# EAGLE design FR5969 (EAGLE 9.6.2)
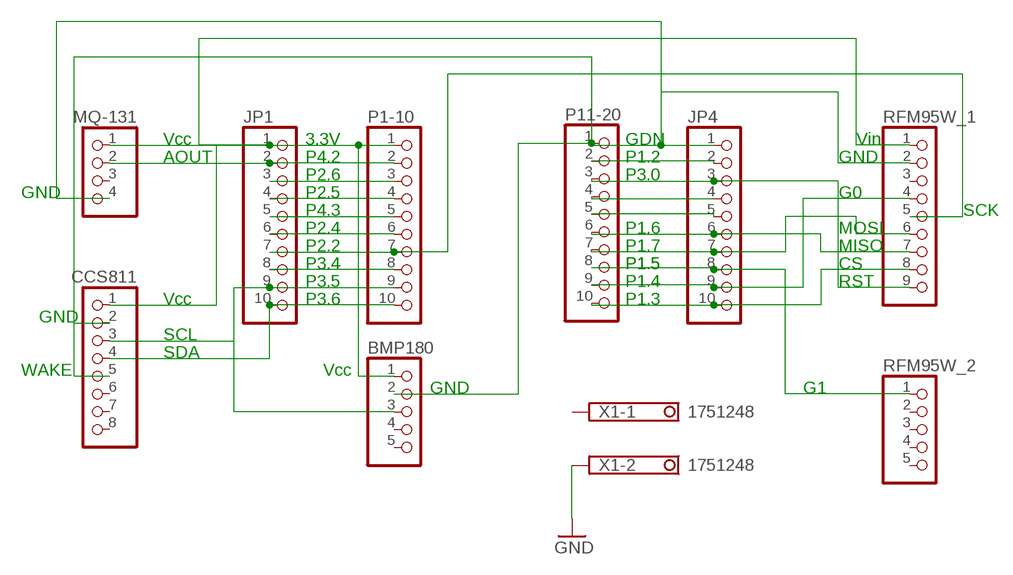
[diagram p0: schematic, sheet 1]

## Parts
BMP180  PINHD-1X5  [1X05]
CCS811  PINHD-1X8  [1X08]
JP1  PINHD-1X10  [1X10]
JP4  PINHD-1X10  [1X10]
MQ-131  PINHD-1X4  [1X04]
P1-10  PINHD-1X10  [1X10]
P11-20  PINHD-1X10  [1X10]
RFM95W_1  PINHD-1X9  [1X09]
RFM95W_2  PINHD-1X5  [1X05]
X1  1751248  [1751248]

## Nets
GND: X1.2
N$1: BMP180.1 CCS811.1 JP1.1 MQ-131.1 P1-10.1 RFM95W_1.1
N$2: JP1.2 MQ-131.2 P1-10.2
N$3: JP1.3 P1-10.3
N$4: JP1.4 P1-10.4
N$5: JP1.5 P1-10.5
N$6: JP1.6 P1-10.6
N$7: JP1.7 P1-10.7 RFM95W_1.5
N$8: JP1.8 P1-10.8
N$9: BMP180.3 CCS811.3 JP1.9 P1-10.9
N$10: CCS811.4 JP1.10 P1-10.10
N$11: JP4.10 P11-20.10 RFM95W_1.8
N$12: JP4.9 P11-20.9 RFM95W_1.4
N$13: JP4.8 P11-20.8 RFM95W_2.1
N$14: JP4.7 P11-20.7 RFM95W_1.6
N$15: JP4.6 P11-20.6 RFM95W_1.7
N$16: JP4.5 P11-20.5
N$17: JP4.4 P11-20.4
N$18: JP4.3 P11-20.3 RFM95W_1.9
N$19: JP4.2 P11-20.2
N$20: BMP180.2 CCS811.2 CCS811.5 JP4.1 MQ-131.4 P11-20.1 RFM95W_1.2
Unconnected: BMP180.4 BMP180.5 CCS811.6 CCS811.7 CCS811.8 MQ-131.3 RFM95W_1.3 RFM95W_2.2 RFM95W_2.3 RFM95W_2.4 RFM95W_2.5 X1.1

## Notes on the sheet
- Vcc | 3.3V | GDN | Vin
- AOUT | P4.2 | P1.2 | GND
- P2.6 | P3.0
- GND | P2.5 | G0
- P4.3 | SCK
- P2.4 | P1.6 | MOSI
- P2.2 | P1.7 | MISO
- P3.4 | P1.5 | P1.5 | CS
- P3.5 | P1.4 | RST
- Vcc | P3.6 | P1.3
- GND
- SCL
- SDA
- WAKE | Vcc
- GND | G1

## Library data of the parts
BMP180 RFM95W_2 = pinhead:PINHD-1X5: PIN HEADER
CCS811 = pinhead:PINHD-1X8: PIN HEADER
JP1 JP4 P1-10 P11-20 = pinhead:PINHD-1X10: PIN HEADER
MQ-131 = pinhead:PINHD-1X4: PIN HEADER
RFM95W_1 = pinhead:PINHD-1X9: PIN HEADER
X1 = con-phoenix-350:1751248: MKDS 1/ 2-3,5 Printklemme Nennstrom: 10 A Bemessungsspannung: 160 V Raster: 3,5 mm Polzahl: 2 Montageart: Löten Anschlussart: Schraubanschluss Anschlussrichtung vom Leiter zur Platine: 0° Source: http://eshop.phoenixcontact.com .. 1751248.pdf; OC_FARNELL: unknown; OC_NEWARK: unknown

## Board
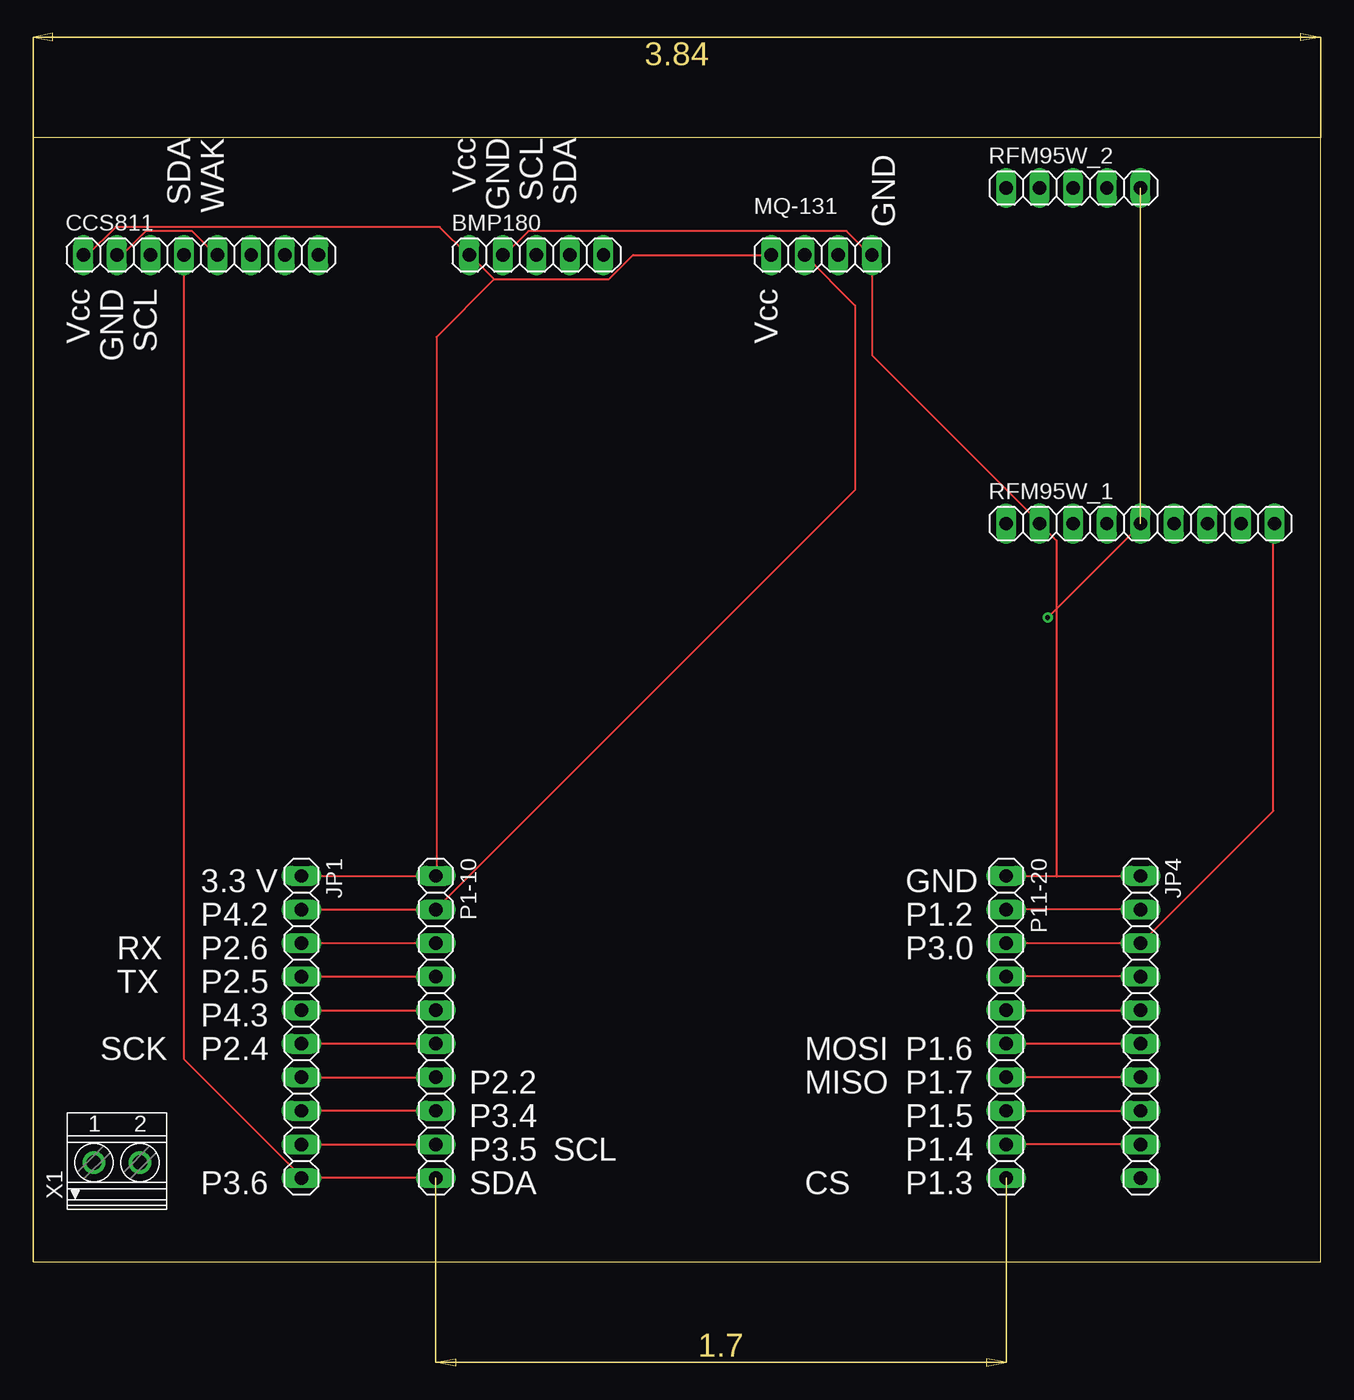
[diagram p1: board, top side]
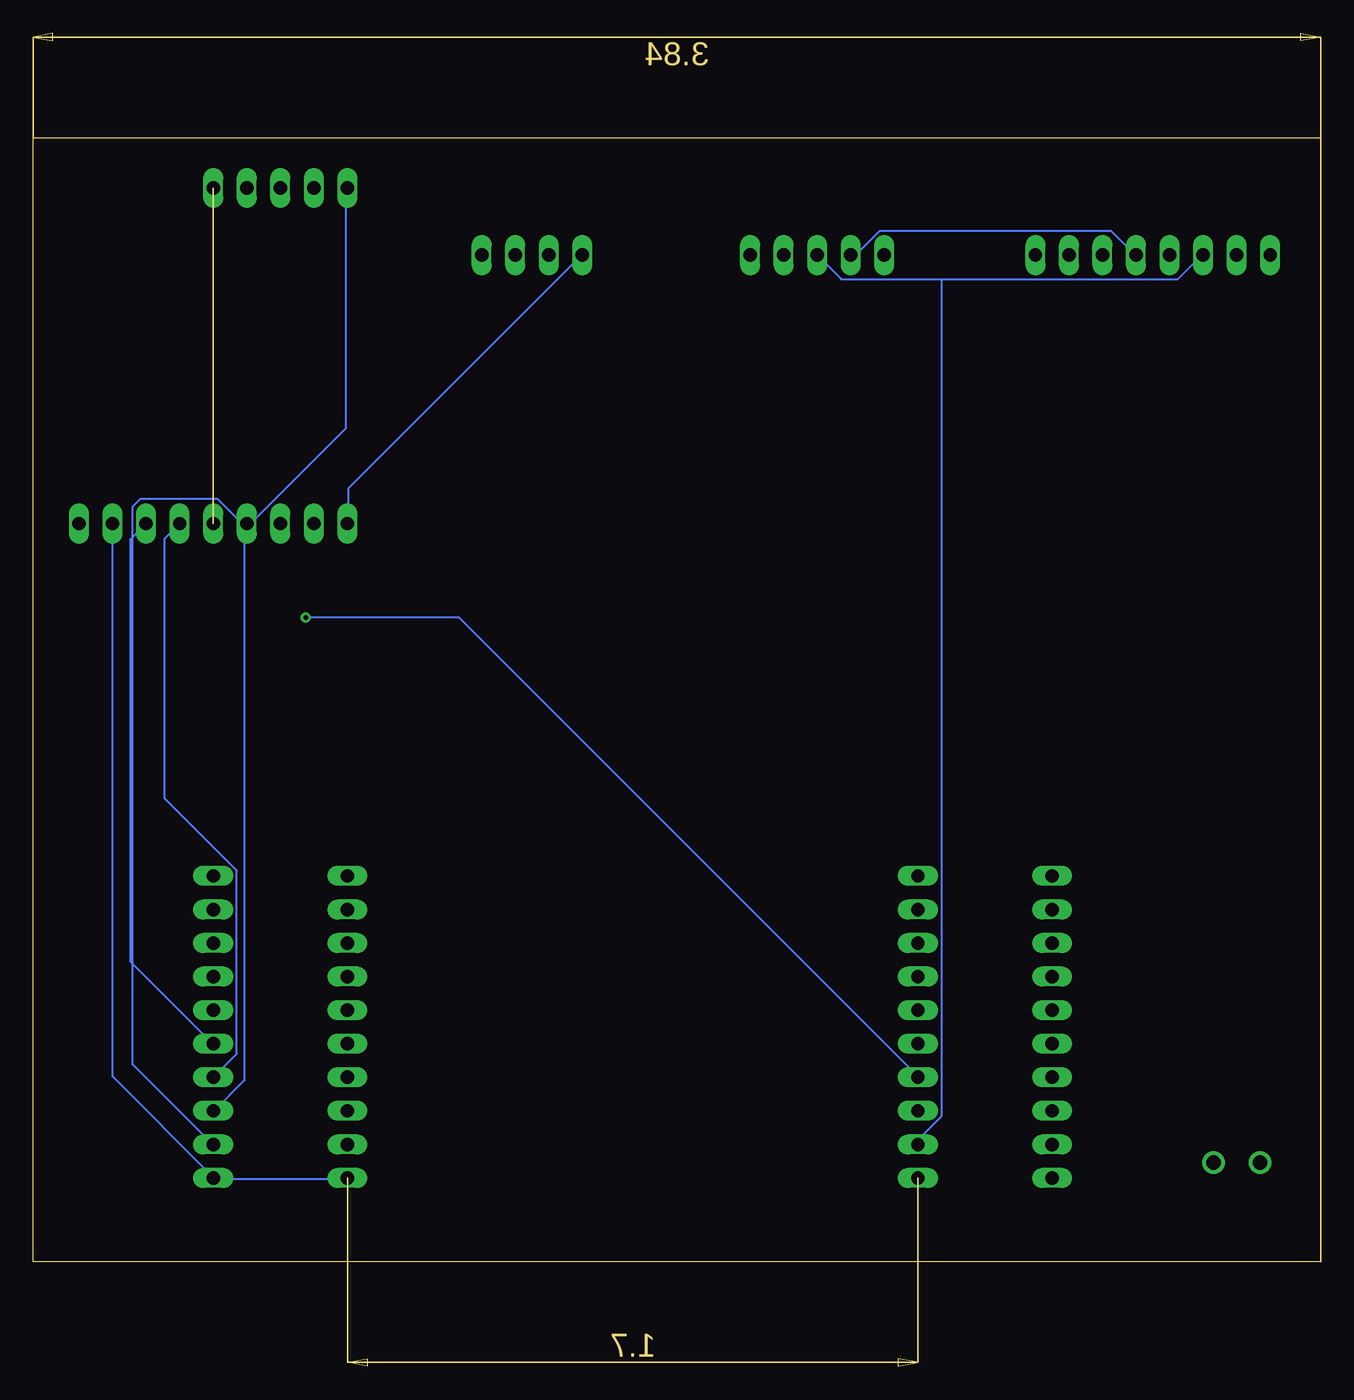
[diagram p2: board, bottom side, seen from below]

Size 97.46 x 85.08 mm. Coordinates in mm from the lower left corner, seen from the top.
Outline: 0,0 97.46,0 97.46,85.08 0,85.08 0,0
Copper layers (1*16): Top 0.035mm / dielectric 1.5mm / Bottom 0.035mm
Design rules "default": minimum track width 6mil, minimum drill 0.35mm, track to track 6mil, track to pad 6mil, pad to pad 6mil, via to via 6mil, smd to smd 6mil, copper to edge 40mil, drill to drill 6mil, minimum pad ring 10mil, minimum via ring 8mil, stop-mask expansion 4mil, vias tented up to drill 0mil, thermal gap 10mil

### Footprints (pad centres in the part's own frame; a part is rotated, then mirrored left to right if it is on the bottom)
1X05 = drill 1.016 long: 1 -5.08,0; 2 -2.54,0; 3 0,0; 4 2.54,0; 5 5.08,0
1X08 = drill 1.016 long: 1 -8.89,0; 2 -6.35,0; 3 -3.81,0; 4 -1.27,0; 5 1.27,0; 6 3.81,0; 7 6.35,0; 8 8.89,0
1X10 = drill 1.016 long: 1 -11.43,0; 2 -8.89,0; 3 -6.35,0; 4 -3.81,0; 5 -1.27,0; 6 1.27,0; 7 3.81,0; 8 6.35,0; 9 8.89,0; 10 11.43,0
1X04 = drill 1.016 long: 1 -3.81,0; 2 -1.27,0; 3 1.27,0; 4 3.81,0
1X09 = drill 1.016 long: 1 -10.16,0; 2 -7.62,0; 3 -5.08,0; 4 -2.54,0; 5 0,0; 6 2.54,0; 7 5.08,0; 8 7.62,0; 9 10.16,0
1751248 = drill 1.1 pad 1.7: 1 -1.75,-0.1; 2 1.75,-0.1

### Placement (x,y rotation side)
BMP180  38.1,76.2 0 top
CCS811  12.7,76.2 0 top
JP1  20.32,17.78 270 top
JP4  83.82,17.78 270 top
MQ-131  59.69,76.2 0 top
P1-10  30.48,17.78 270 top
P11-20  73.66,17.78 270 top
RFM95W_1  83.82,55.88 0 top
RFM95W_2  78.74,81.28 0 top
X1  6.35,7.62 0 top

### Tracks (layer width: path | path; a pad name or v marks a point on that pad's centre or on a via)
N$1
  Top 0.152: JP1.1 P1-10.1 30.53,29.31 30.53,70 34.9,74.37 | CCS811.1 4.12,76.2 6.25,78.33 30.79,78.33 32.92,76.2 BMP180.1 33.07,76.2 34.9,74.37 | MQ-131.1 45.41,76.2 43.59,74.37 34.9,74.37
  Bottom 0.152: RFM95W_1.1 73.61,55.93 73.61,58.52 55.93,76.2 MQ-131.1
N$2
  Top 0.152: JP1.2 P1-10.2 62.23,58.42 62.23,72.39 MQ-131.2
N$3
  Top 0.152: JP1.3 P1-10.3
N$4
  Top 0.152: JP1.4 P1-10.4
N$5
  Top 0.152: JP1.5 P1-10.5
N$6
  Top 0.152: P1-10.6 JP1.6
N$7  (via drill 0.35)
  Top 0.152: JP1.7 P1-10.7 | v76.81,48.77 83.82,55.78 RFM95W_1.5
  Bottom 0.152: v76.81,48.77 65.23,48.77 30.53,14.07 P1-10.7
N$8
  Top 0.152: P1-10.8 JP1.8
N$9
  Top 0.152: JP1.9 P1-10.9
  Bottom 0.152: 28.7,74.37 36.27,74.37 BMP180.3 | 28.7,74.37 10.82,74.37 8.99,76.2 CCS811.3 | 28.7,74.37 28.7,11.02 30.38,9.35 30.38,8.89 P1-10.9
N$10
  Top 0.152: P1-10.10 JP1.10 20.32,6.45 11.43,15.34 CCS811.4
N$11
  Bottom 0.152: P11-20.10 73.66,6.3 83.72,6.3 JP4.10 83.87,6.45 91.44,14.02 RFM95W_1.8
N$12
  Top 0.152: JP4.9 P11-20.9
  Bottom 0.152: RFM95W_1.4 81.38,55.93 81.69,55.93 83.52,57.76 89.31,57.76 89.92,57.15 89.92,14.94 83.87,8.89 JP4.9
N$13
  Top 0.152: P11-20.8 JP4.8
  Bottom 0.152: RFM95W_2.1 73.76,81.23 73.76,63.09 81.43,55.42 81.43,13.77 83.72,11.48 JP4.8
N$14
  Top 0.152: JP4.7 P11-20.7
  Bottom 0.152: RFM95W_1.6 87.53,54.71 87.53,35.1 82.04,29.62 82.04,15.75 JP4.7
N$15
  Top 0.152: JP4.6 P11-20.6
  Bottom 0.152: RFM95W_1.7 90.12,54.66 90.12,22.76 83.87,16.51 JP4.6
N$16
  Top 0.152: P11-20.5 JP4.5
N$17
  Top 0.152: JP4.4 P11-20.4
N$18
  Top 0.152: P11-20.3 JP4.3 83.87,24.13 93.88,34.14 93.88,55.78 RFM95W_1.9
N$19
  Top 0.152: JP4.2 P11-20.2
N$20
  Top 0.152: P11-20.1 77.47,29.21 | 77.47,29.21 JP4.1 | CCS811.2 6.71,76.2 8.53,78.03 12.04,78.03 13.87,76.2 CCS811.5 | 77.47,29.21 77.47,54.61 RFM95W_1.2 76.2,55.93 63.55,68.58 63.55,76.2 MQ-131.4 63.4,76.2 61.57,78.03 37.49,78.03 35.66,76.2 BMP180.2 | 77.47,29.21 77.47,29.16
  Bottom 0.152: BMP180.2 35.2,76.2 33.38,78.03 15.85,78.03 14.02,76.2 CCS811.5

### Text on the board
tNames: SDA | WAK | Vcc | GND | SCL | SDA | GND | Vcc | GND | SCL | Vcc | 3.3 V | GND | P4.2 | P1.2 | RX | P2.6 | P3.0 | TX | P2.5 | P4.3 | SCK | P2.4 | MOSI | P1.6 | P2.2 | MISO | P1.7 | P3.4 | P1.5 | P3.5 | SCL | P1.4 | P3.6 | SDA | CS | P1.3